# Altium schematic sheet Embedded_System_Top.SchDoc
size A; SheetNumber: 2; SheetTotal: 9
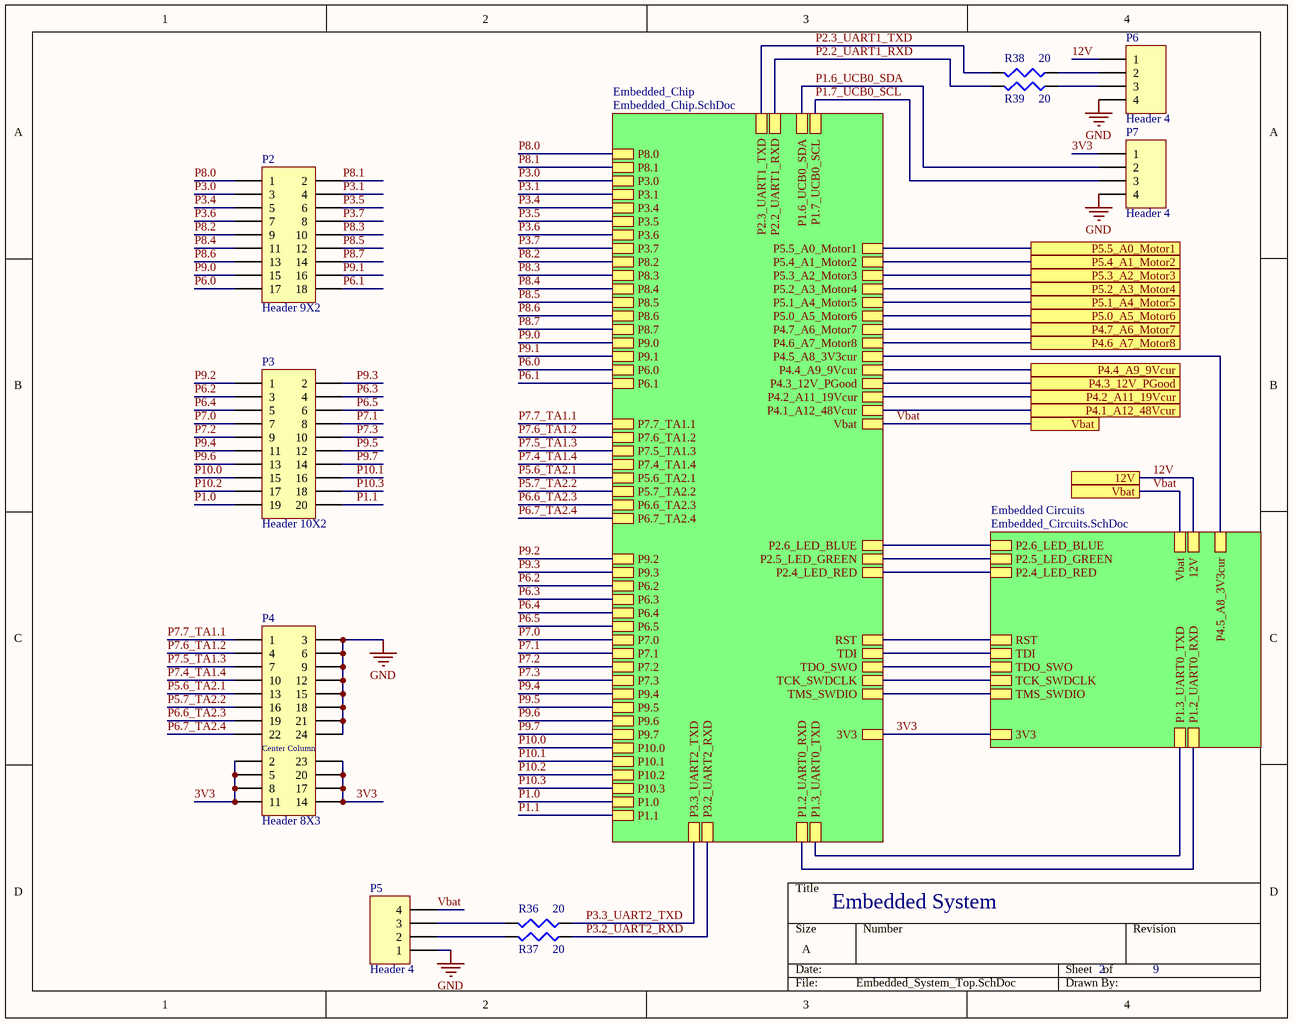
[diagram p0: Embedded_System_Top.SchDoc]

## Parts
P2  Header 9X2  [Header 2x9]
P3  Header 10X2  [Header 2x10]
P4  Header 8X3  [Header 8X3]
P5  Header 4  [Header 1x4]
P6  Header 4  [Header 1x4]
P7  Header 4  [Header 1x4]
R36  value 20  [J1-0603]  (hidden comment: Res3)
R37  value 20  [J1-0603]  (hidden comment: Res3)
R38  value 20  [J1-0603]  (hidden comment: Res3)
R39  value 20  [J1-0603]  (hidden comment: Res3)

## Sub-sheets
Embedded Circuits = Embedded_Circuits.SchDoc: 3V3, RST, P2.4_LED_RED, P2.5_LED_GREEN, P2.6_LED_BLUE, TDI, TDO_SWO, TCK_SWDCLK, TMS_SWDIO, P1.2_UART0_RXD, P1.3_UART0_TXD, Vbat, 12V, P4.5_A8_3V3cur
Embedded_Chip = Embedded_Chip.SchDoc: 3V3, RST, P2.4_LED_RED, P2.6_LED_BLUE, P2.5_LED_GREEN, TDI, TDO_SWO, TCK_SWDCLK, TMS_SWDIO, P1.2_UART0_RXD, P1.3_UART0_TXD, Vbat, P4.1_A12_48Vcur, P4.2_A11_19Vcur, P4.3_12V_PGood, P4.4_A9_9Vcur, P4.5_A8_3V3cur, P4.6_A7_Motor8, P4.7_A6_Motor7, P5.0_A5_Motor6, P5.1_A4_Motor5, P5.2_A3_Motor4, P5.3_A2_Motor3, P5.4_A1_Motor2, P5.5_A0_Motor1, P2.2_UART1_RXD, P2.3_UART1_TXD, P8.3, P8.4, P8.5, P8.6, P8.7, P9.1, P9.0, P6.0, P6.1, P3.3_UART2_TXD, P3.4, P3.1, P3.2_UART2_RXD, P3.0, P8.2, P3.7, P3.5, P3.6, P8.1, P8.0, P7.4_TA1.4, P7.6_TA1.2, P7.5_TA1.3, P7.7_TA1.1, P5.6_TA2.1, P5.7_TA2.2, P9.2, P9.3, P6.2, P6.3, P6.4, P6.5, P6.6_TA2.3, P6.7_TA2.4, P7.0, P7.1, P7.2, P7.3, P9.4, P9.5, P9.6, P9.7, P10.0, P10.1, P10.2, P10.3, P1.0, P1.1, P1.6_UCB0_SDA, P1.7_UCB0_SCL

## Ports
12V, P4.1_A12_48Vcur, P4.2_A11_19Vcur, P4.3_12V_PGood, P4.4_A9_9Vcur, P4.6_A7_Motor8, P4.7_A6_Motor7, P5.0_A5_Motor6, P5.1_A4_Motor5, P5.2_A3_Motor4, P5.3_A2_Motor3, P5.4_A1_Motor2, P5.5_A0_Motor1, Vbat

## Nets
GND: P4.3 P4.6 P4.9 P4.12 P4.15 P4.18 P4.21 P4.24 P5.1 P6.4 P7.4
3V3: P4.2 P4.5 P4.8 P4.11 P4.14 P4.17 P4.20 P4.23 P7.1 ; sheet Embedded_Chip/3V3, sheet Embedded Circuits/3V3
12V: P6.1 ; port 12V, sheet Embedded Circuits/12V
P1.0: P3.19 ; sheet Embedded_Chip/P1.0
P1.1: P3.20 ; sheet Embedded_Chip/P1.1
P1.6_UCB0_SDA: P7.2 ; sheet Embedded_Chip/P1.6_UCB0_SDA
P1.7_UCB0_SCL: P7.3 ; sheet Embedded_Chip/P1.7_UCB0_SCL
P2.2_UART1_RXD: R39.2 ; sheet Embedded_Chip/P2.2_UART1_RXD
P2.3_UART1_TXD: R38.2 ; sheet Embedded_Chip/P2.3_UART1_TXD
P3.0: P2.3 ; sheet Embedded_Chip/P3.0
P3.1: P2.4 ; sheet Embedded_Chip/P3.1
P3.2_UART2_RXD: R37.1 ; sheet Embedded_Chip/P3.2_UART2_RXD
P3.3_UART2_TXD: R36.1 ; sheet Embedded_Chip/P3.3_UART2_TXD
P3.4: P2.5 ; sheet Embedded_Chip/P3.4
P3.5: P2.6 ; sheet Embedded_Chip/P3.5
P3.6: P2.7 ; sheet Embedded_Chip/P3.6
P3.7: P2.8 ; sheet Embedded_Chip/P3.7
P4.1_A12_48Vcur: port P4.1_A12_48Vcur, sheet Embedded_Chip/P4.1_A12_48Vcur
P4.2_A11_19Vcur: port P4.2_A11_19Vcur, sheet Embedded_Chip/P4.2_A11_19Vcur
P4.3_12V_PGood: port P4.3_12V_PGood, sheet Embedded_Chip/P4.3_12V_PGood
P4.4_A9_9Vcur: port P4.4_A9_9Vcur, sheet Embedded_Chip/P4.4_A9_9Vcur
P4.6_A7_Motor8: port P4.6_A7_Motor8, sheet Embedded_Chip/P4.6_A7_Motor8
P4.7_A6_Motor7: port P4.7_A6_Motor7, sheet Embedded_Chip/P4.7_A6_Motor7
P5.0_A5_Motor6: port P5.0_A5_Motor6, sheet Embedded_Chip/P5.0_A5_Motor6
P5.1_A4_Motor5: port P5.1_A4_Motor5, sheet Embedded_Chip/P5.1_A4_Motor5
P5.2_A3_Motor4: port P5.2_A3_Motor4, sheet Embedded_Chip/P5.2_A3_Motor4
P5.3_A2_Motor3: port P5.3_A2_Motor3, sheet Embedded_Chip/P5.3_A2_Motor3
P5.4_A1_Motor2: port P5.4_A1_Motor2, sheet Embedded_Chip/P5.4_A1_Motor2
P5.5_A0_Motor1: port P5.5_A0_Motor1, sheet Embedded_Chip/P5.5_A0_Motor1
P5.6_TA2.1: P4.13 ; sheet Embedded_Chip/P5.6_TA2.1
P5.7_TA2.2: P4.16 ; sheet Embedded_Chip/P5.7_TA2.2
P6.0: P2.17 ; sheet Embedded_Chip/P6.0
P6.1: P2.18 ; sheet Embedded_Chip/P6.1
P6.2: P3.3 ; sheet Embedded_Chip/P6.2
P6.3: P3.4 ; sheet Embedded_Chip/P6.3
P6.4: P3.5 ; sheet Embedded_Chip/P6.4
P6.5: P3.6 ; sheet Embedded_Chip/P6.5
P6.6_TA2.3: P4.19 ; sheet Embedded_Chip/P6.6_TA2.3
P6.7_TA2.4: P4.22 ; sheet Embedded_Chip/P6.7_TA2.4
P7.0: P3.7 ; sheet Embedded_Chip/P7.0
P7.1: P3.8 ; sheet Embedded_Chip/P7.1
P7.2: P3.9 ; sheet Embedded_Chip/P7.2
P7.3: P3.10 ; sheet Embedded_Chip/P7.3
P7.4_TA1.4: P4.10 ; sheet Embedded_Chip/P7.4_TA1.4
P7.5_TA1.3: P4.7 ; sheet Embedded_Chip/P7.5_TA1.3
P7.6_TA1.2: P4.4 ; sheet Embedded_Chip/P7.6_TA1.2
P7.7_TA1.1: P4.1 ; sheet Embedded_Chip/P7.7_TA1.1
P8.0: P2.1 ; sheet Embedded_Chip/P8.0
P8.1: P2.2 ; sheet Embedded_Chip/P8.1
P8.2: P2.9 ; sheet Embedded_Chip/P8.2
P8.3: P2.10 ; sheet Embedded_Chip/P8.3
P8.4: P2.11 ; sheet Embedded_Chip/P8.4
P8.5: P2.12 ; sheet Embedded_Chip/P8.5
P8.6: P2.13 ; sheet Embedded_Chip/P8.6
P8.7: P2.14 ; sheet Embedded_Chip/P8.7
P9.0: P2.15 ; sheet Embedded_Chip/P9.0
P9.1: P2.16 ; sheet Embedded_Chip/P9.1
P9.2: P3.1 ; sheet Embedded_Chip/P9.2
P9.3: P3.2 ; sheet Embedded_Chip/P9.3
P9.4: P3.11 ; sheet Embedded_Chip/P9.4
P9.5: P3.12 ; sheet Embedded_Chip/P9.5
P9.6: P3.13 ; sheet Embedded_Chip/P9.6
P9.7: P3.14 ; sheet Embedded_Chip/P9.7
P10.0: P3.15 ; sheet Embedded_Chip/P10.0
P10.1: P3.16 ; sheet Embedded_Chip/P10.1
P10.2: P3.17 ; sheet Embedded_Chip/P10.2
P10.3: P3.18 ; sheet Embedded_Chip/P10.3
Vbat: P5.4 ; port Vbat, sheet Embedded_Chip/Vbat, sheet Embedded Circuits/Vbat
NetP5_2: P5.2 R37.2
NetP5_3: P5.3 R36.2
NetP6_2: P6.2 R38.1
NetP6_3: P6.3 R39.1
(unnamed): sheet Embedded_Chip/RST, sheet Embedded Circuits/RST
(unnamed): sheet Embedded_Chip/P2.4_LED_RED, sheet Embedded Circuits/P2.4_LED_RED
(unnamed): sheet Embedded_Chip/P2.6_LED_BLUE, sheet Embedded Circuits/P2.6_LED_BLUE
(unnamed): sheet Embedded_Chip/P2.5_LED_GREEN, sheet Embedded Circuits/P2.5_LED_GREEN
(unnamed): sheet Embedded_Chip/TDI, sheet Embedded Circuits/TDI
(unnamed): sheet Embedded_Chip/TDO_SWO, sheet Embedded Circuits/TDO_SWO
(unnamed): sheet Embedded_Chip/TCK_SWDCLK, sheet Embedded Circuits/TCK_SWDCLK
(unnamed): sheet Embedded_Chip/TMS_SWDIO, sheet Embedded Circuits/TMS_SWDIO
(unnamed): sheet Embedded_Chip/P1.2_UART0_RXD, sheet Embedded Circuits/P1.2_UART0_RXD
(unnamed): sheet Embedded_Chip/P1.3_UART0_TXD, sheet Embedded Circuits/P1.3_UART0_TXD
(unnamed): sheet Embedded_Chip/P4.5_A8_3V3cur, sheet Embedded Circuits/P4.5_A8_3V3cur

## Notes on the sheet
- Embedded System
- (in symbol Header 8X3 (2mm)) Center Column

## Library data of the parts
P2 = Header 9X2: Header, 9-Pin, Dual row; LatestRevisionDate: 17-Jul-2002; LatestRevisionNote: Re-released for DXP Platform.; Publisher: Altium Limited
P3 = Header 10X2: Header, 10-Pin, Dual row; LatestRevisionDate: 17-Jul-2002; LatestRevisionNote: Re-released for DXP Platform.; Publisher: Altium Limited
P4 = Header 8X3 (2mm): Connector Header Through Hole 24 position 0.079" (2.00mm); Digikey: https://www.digikey.com/product-detail/en/samtec-inc/TMMH-108-01-T-T/SAM12190-ND/6692344; Drawing: http://suddendocs.samtec.com/prints/tmmh-1xx-xx-xx-x-xxx-mkt.pdf
P5-P7 = Header 4: Header, 4-Pin; LatestRevisionDate: 17-Jul-2002; LatestRevisionNote: Re-released for DXP Platform.; Publisher: Altium Limited
R36-R39 = Res3: Resistor; Published: 8-Jun-2000; LatestRevisionDate: 29-May-2009; LatestRevisionNote: IPC-7351 Footprint Added.; PackageReference: J1-0603; Publisher: Altium Limited; PackageDescription: Chip Resistor